# Altium schematic sheet Supplies.SchDoc
size A; DocumentNumber: 6; SheetNumber: 6
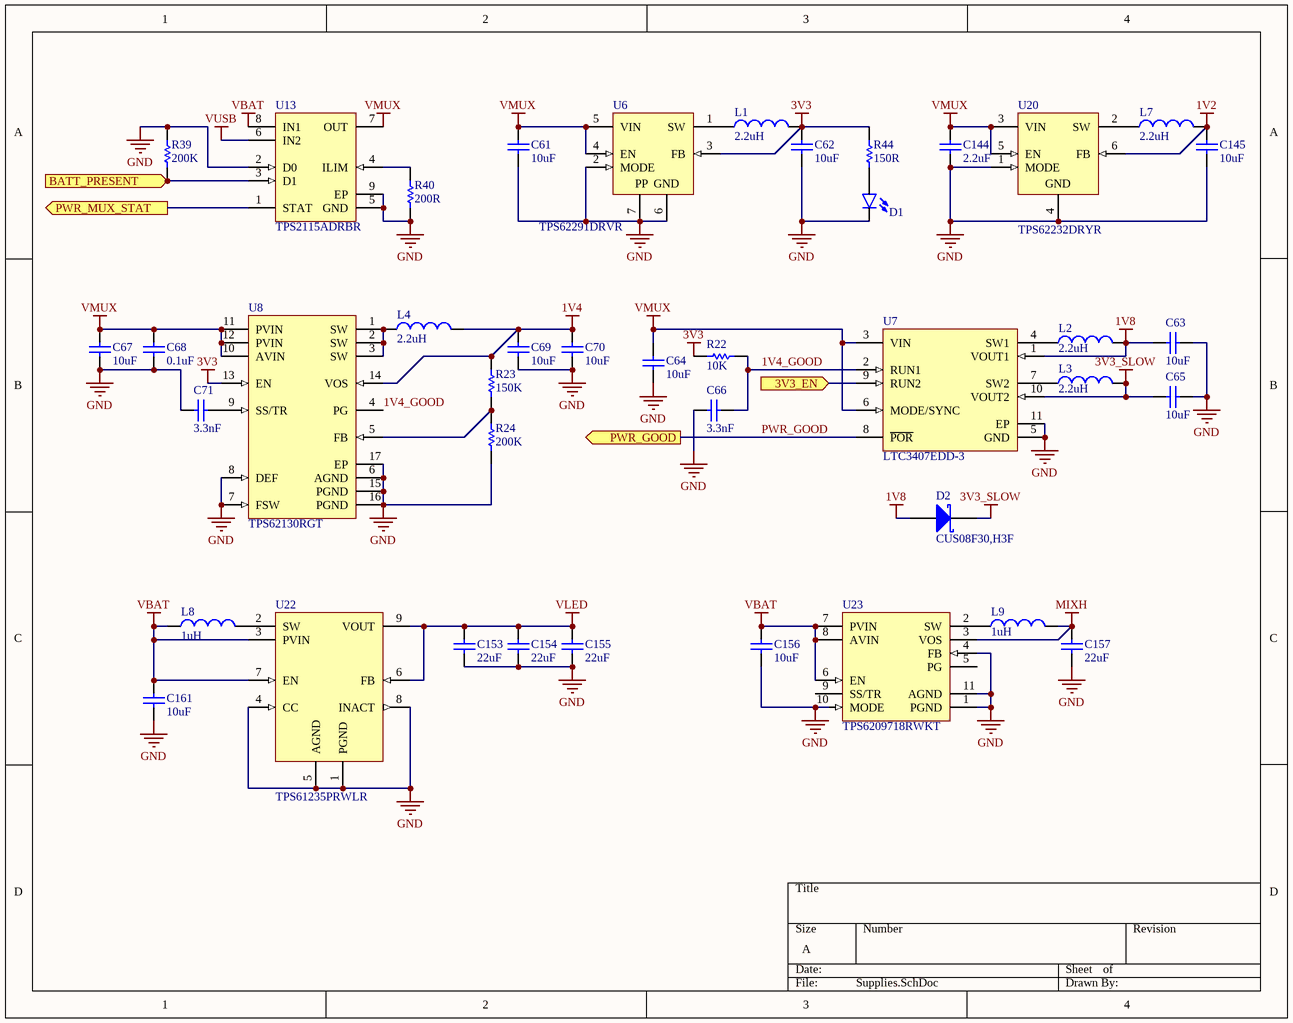
[diagram p0: Supplies.SchDoc]

## Parts
C61  value 10uF  [C0402[1005X55]]  (hidden comment: 10uF 6.3V 0402)
C62  value 10uF  [C0402[1005X55]]  (hidden comment: 10uF 6.3V 0402)
C63  value 10uF  [C0402[1005X55]]  (hidden comment: 10uF 6.3V 0402)
C64  value 10uF  [C0402[1005X55]]  (hidden comment: 10uF 6.3V 0402)
C65  value 10uF  [C0402[1005X55]]  (hidden comment: 10uF 6.3V 0402)
C66  value 3.3nF  [C0402[1005X55]]  (hidden comment: 3.3nF 50V 0402)
C67  value 10uF  [C0402[1005X55]]  (hidden comment: 10uF 6.3V 0402)
C68  value 0.1uF  [C0402[1005X55]]  (hidden comment: 0.1uF 6.3V 0402)
C69  value 10uF  [C0402[1005X55]]  (hidden comment: 10uF 6.3V 0402)
C70  value 10uF  [C0402[1005X55]]  (hidden comment: 10uF 6.3V 0402)
C71  value 3.3nF  [C0402[1005X55]]  (hidden comment: 3.3nF 50V 0402)
C144  value 2.2uF  [C0402[1005X55]]  (hidden comment: 2.2uF 6.3V 0402)
C145  value 10uF  [C0402[1005X55]]  (hidden comment: 10uF 6.3V 0402)
C153  value 22uF  [C0603[1608X92]]  (hidden comment: 22uF 6.3V 0603)
C154  value 22uF  [C0603[1608X92]]  (hidden comment: 22uF 6.3V 0603)
C155  value 22uF  [C0603[1608X92]]  (hidden comment: 22uF 6.3V 0603)
C156  value 10uF  [C0402[1005X55]]  (hidden comment: 10uF 6.3V 0402)
C157  value 22uF  [C0603[1608X92]]  (hidden comment: 22uF 6.3V 0603)
C161  value 10uF  [C0402[1005X55]]  (hidden comment: 10uF 6.3V 0402)
D1  LED_0603_BLUE_5mA  [LED0603]  (value not drawn)
D2  CUS08F30,H3F  [SOD-323]
L1  2.2uH  [IND0805]
L2  2.2uH  [IND0603]
L3  2.2uH  [IND0603]
L4  2.2uH  [IND1008]
L7  2.2uH  [IND0603]
L8  1uH  [IND1008]
L9  1uH  [IND0805]
R22  value 10K  [R0402[1005]]  (hidden comment: 10K 1% 0402)
R23  value 150K  [R0402[1005]]  (hidden comment: 150K 1% 0402)
R24  value 200K  [R0402[1005]]  (hidden comment: 200K 1% 0402)
R39  value 200K  [R0402[1005]]  (hidden comment: 200K 1% 0402)
R40  value 200R  [R0402[1005]]  (hidden comment: 200R 1% 0402)
R44  value 150R  [R0402[1005]]  (hidden comment: 150R 1% 0402)
U6  TPS62291DRVR  [WSON-6]
U7  LTC3407EDD-3  [VSON-10 (3mmx3mm)]
U8  TPS62130RGT  [QFN-16]
U13  TPS2115ADRBR  [VSON-8 (3x3MM)]
U20  TPS62232DRYR  [USON-6]
U22  TPS61235PRWLR  [VQFN-9]
U23  TPS6209718RWKT  [VQFN-11]

## Ports
3V3_EN (in), BATT_PRESENT (in), PWR_GOOD (out), PWR_MUX_STAT (out)

## Nets
1V2: C145.2 L7.2 U20.6(FB)
1V4: C69.2 C70.2 L4.2 R23.2 U8.14(VOS)
1V8: C63.2 D2.2(A) L2.2 U7.1(VOUT1)
3V3: C62.2 L1.2 R22.1 R44.2 U6.3(FB) U8.13(EN)
3V3_SLOW: C65.1 D2.1(K) L3.2 U7.10(VOUT2)
GND: C61.1 C62.1 C63.1 C64.1 C65.2 C66.1 C67.1 C68.1 C69.1 C70.1 C71.1 C144.1 C145.1 C153.1 C154.1 C155.1 C156.1 C157.1 C161.1 D1.C R24.1 R39.2 R40.1 U6.2(MODE) U6.6(GND) U6.7(EP) U7.5(GND) U7.11(EP) U8.6(AGND) U8.7(FSW) U8.8(DEF) U8.15(PGND) U8.16(PGND) U8.17(EP) U13.2(D0) U13.5(GND) U13.9(EP) U20.1(MODE) U20.4(GND) U22.1(PGND) U22.4(CC) U22.5(AGND) U22.8(INACT) U23.1(PGND) U23.4(FB) U23.10(MODE) U23.11(AGND)
MIXH: C157.2 L9.2 U23.3(VOS)
VBAT: C156.2 C161.2 L8.1 U13.8(IN1) U22.3(PVIN) U22.7(EN) U23.6(EN) U23.7(PVIN) U23.8(AVIN)
VLED: C153.2 C154.2 C155.2 U22.6(FB) U22.9(VOUT)
VMUX: C61.2 C64.2 C67.2 C68.2 C144.2 U6.4(EN) U6.5(VIN) U7.3(VIN) U7.6(MODE/SYNC) U8.10(AVIN) U8.11(PVIN) U8.12(PVIN) U13.7(OUT) U20.3(VIN) U20.5(EN)
VUSB: U13.6(IN2)
1V4_GOOD: C66.2 R22.2 U7.2(RUN1) U8.4(PG)
3V3_EN: U7.9(RUN2) ; port 3V3_EN
BATT_PRESENT: R39.1 U13.3(D1) ; port BATT_PRESENT
PWR_GOOD: U7.8(~{POR}) ; port PWR_GOOD
PWR_MUX_STAT: U13.1(STAT) ; port PWR_MUX_STAT
NetC71_2: C71.2 U8.9(SS/TR)
NetD1_A: D1.A R44.1
NetL1_1: L1.1 U6.1(SW)
NetL2_1: L2.1 U7.4(SW1)
NetL3_1: L3.1 U7.7(SW2)
NetL4_1: L4.1 U8.1(SW) U8.2(SW) U8.3(SW)
NetL7_1: L7.1 U20.2(SW)
NetL8_2: L8.2 U22.2(SW)
NetL9_1: L9.1 U23.2(SW)
NetR23_1: R23.1 R24.2 U8.5(FB)
NetR40_2: R40.2 U13.4(ILIM)

Not connected (* = marked no-connect by the designer): U23 5(PG) 9(SS/TR)

## Notes on the sheet
- (in symbol TPS62291DRVR) PP

## Library data of the parts
C61-C65 C67 C69 C70 C145 C156 C161 = CAP_10uF_6.3V_0402_20%: 10uF 6.3V 20% 0402 (1005 Metric); PartNumber: GRM155R60J106ME44D; Manufacturer: Murata; Tolerance: 20%; Mounting Technology: Surface Mount; PackageReference: 0402; PackageDescription: 0402 (1005 Metric); Voltage: 6.3V
C66 C71 = CAP_3.3nF_50V_0402_10%: 3.3nF 50V 10% 0402 (1005 Metric); PartNumber: GRM155R71H332KA01D; Manufacturer: Murata; Mounting Technology: Surface Mount; PackageReference: 0402; PackageDescription: 0402 (1005 Metric); Voltage: 50V; Tolerance: 10%
C68 = CAP_0.1uF_6.3V_0402_10%: 0.1uF 6.3V 10% 0402 (1005 Metric); PartNumber: GRM155R70J104KA01D; Manufacturer: Murata; Mounting Technology: Surface Mount; PackageReference: 0402; PackageDescription: 0402 (1005 Metric); Voltage: 6.3V; Tolerance: 10%
C144 = CAP_2.2uF_6.3V_0402_20%: 2.2uF 6.3V 20% 0402 (1005 Metric); PartNumber: GRM155R60J225ME15D; Manufacturer: Murata; Mounting Technology: Surface Mount; PackageReference: 0402; PackageDescription: 0402 (1005 Metric); Voltage: 6.3V; Tolerance: 20%
C153-C155 C157 = CAP_22uF_6.3V_0603_10%: 22uF 6.3V 10% 0603 (1608 Metric); PartNumber: GRT188R60J226ME13D; Manufacturer: Murata; Mounting Technology: Surface Mount; PackageReference: 0603; PackageDescription: 0603 (1608 Metric); Voltage: 6.3V; Tolerance: 10%
D1 = LED_0603_BLUE_5mA: PartNumber: LTST-C193TBKT-5A; Manufacturer: Lite-On Inc.; PackageReference: 0603; PackageDescription: 0603 (1608 Metric); Mounting Technology: Surface Mount
D2 = CUS08F30,H3F: Manufacturer: Toshiba; PackageReference: SOD-323; PartNumber: CUS08F30,H3F; Mounting Technology: Surface Mount
L1 = IND_2.2uH_1.7A_0805_20%: 2.2uH 20% 1.7A 0805; PartNumber: LQM21PN2R2MGHL; Manufacturer: Murata; PackageReference: 0805; PackageDescription: 0805 (2012 metric); Value: 2.2uH; Mounting Technology: Surface Mount; Current: 1.7A
L2 L3 L7 = IND_2.2uH_750mA_0603_20%: 2.2uH 20% 750mA 0603; PartNumber: LQM18PZ2R2MCHD; Manufacturer: Murata; PackageReference: 0603; PackageDescription: 0603 (1608 metric); Value: 2.2uH; Mounting Technology: Surface Mount; Current: 750mA
L4 = IND_2.2uH_3.3A_1008_20%: 2.2uH 20% 3.3A 1008; PartNumber: DFE252012F-2R2M=P2; Manufacturer: Murata; PackageReference: 1008; PackageDescription: 1008 (2520 metric); Mounting Technology: Surface Mount; Current: 3.3A; Value: 2.2uH
L8 = IND_1uH_4.7A_1008_20%: 1uH 20% 4.7A 1008; PartNumber: DFE252012F-2R2M=P2; Manufacturer: Murata; PackageReference: 1008; PackageDescription: 1008 (2520 metric); Mounting Technology: Surface Mount; Current: 4.7A; Value: 1uH
L9 = IND_1uH_2.3A_0805_20%: 1uH 20% 2.3A 0805; PartNumber: DFE201210S-1R0M=P2; Manufacturer: Murata; PackageReference: 0805; PackageDescription: 0805 (2012 metric); Mounting Technology: Surface Mount; Current: 2.3A; Value: 1uH
R22 = RES_10K_0402_1%: 10K 0.063W 1% 0402 (1005 Metric); Manufacturer: KOA Speer; PartNumber: RK73H1ETTP1002F; Tolerance: 1%; Power: 0.063W; Mounting Technology: Surface Mount; PackageReference: 0402; PackageDescription: 0402 (1005 Metric); ComponentLink1Description: Datasheet; ComponentLink1URL: http://www.koaspeer.com/catimages/Products/RK73H/RK73H.pdf
R23 = RES_150K_0402_1%: 150K 0.063W 1% 0402 (1005 Metric); Manufacturer: KOA Speer; PartNumber: RK73H1ETTP1503F; Tolerance: 1%; Power: 0.063W; Mounting Technology: Surface Mount; PackageReference: 0402; PackageDescription: 0402 (1005 Metric); ComponentLink1Description: Datasheet; ComponentLink1URL: http://www.koaspeer.com/catimages/Products/RK73H/RK73H.pdf
R24 R39 = RES_200K_0402_1%: 200K 0.063W 1% 0402 (1005 Metric); Manufacturer: KOA Speer; PartNumber: RK73H1ETTP2003F; Tolerance: 1%; Power: 0.063W; Mounting Technology: Surface Mount; PackageReference: 0402; PackageDescription: 0402 (1005 Metric); ComponentLink1Description: Datasheet; ComponentLink1URL: http://www.koaspeer.com/catimages/Products/RK73H/RK73H.pdf
R40 = RES_200R_0402_1%: 200R 0.063W 1% 0402 (1005 Metric); Manufacturer: KOA Speer; PartNumber: RK73H1ETTP2000F; Tolerance: 1%; Power: 0.063W; Mounting Technology: Surface Mount; PackageReference: 0402; PackageDescription: 0402 (1005 Metric); ComponentLink1Description: Datasheet; ComponentLink1URL: http://www.koaspeer.com/catimages/Products/RK73H/RK73H.pdf
R44 = RES_150R_0402_1%: 150R 0.063W 1% 0402 (1005 Metric); Manufacturer: KOA Speer; PartNumber: RK73H1ETTP1500F; Tolerance: 1%; Power: 0.063W; Mounting Technology: Surface Mount; PackageReference: 0402; PackageDescription: 0402 (1005 Metric); ComponentLink1Description: Datasheet; ComponentLink1URL: http://www.koaspeer.com/catimages/Products/RK73H/RK73H.pdf
U6 = TPS62291DRVR: Voltage Regulators - Switching Regulators 2.25MHz 1A Step-Down Cnvrtr 3.3V Output; Manufacturer: Texas Instruments; PartNumber: TPS62291DRVR; PackageReference: WSON-6; PackageDescription: SON, 6-Leads, Body 2x2mm, Pitch 0.65mm, Thermal Pad 1.6x1mm, TI Recommended; Mounting Technology: Surface Mount
U7 = LTC3407EDD-3: Manufacturer: Linear Technology; PartNumber: LTC3407EDD-3; PackageReference: SON-10; Mounting Technology: Surface Mount
U8 = TPS62130RGT: Manufacturer: Texas Instruments; PartNumber: TPS62130RGT; PackageReference: QFN-16; Mounting Technology: Surface Mount
U13 = TPS2115ADRBR: Power Switch ICs - Power Distribution Autoswitching Pwr Mux; Manufacturer: Texas Instruments; PartNumber: TPS2115ADRBR; PackageReference: VSON-8; Mounting Technology: Surface Mount
U20 = TPS62232DRYR: Switching Voltage Regulators 3 MHz Ultra Small Step Down Converter; Manufacturer: Texas Instruments; PartNumber: TPS62232DRYR; PackageReference: USON-6; Mounting Technology: Surface Mount
U22 = TPS61235PRWLR: Manufacturer: Texas Instruments; PartNumber: TPS61235PRWLR; PackageReference: VQFN-9; Mounting Technology: Surface Mount
U23 = TPS6209718RWKT: TPS62097 2-A High Efficiency Step-Down Converter with iDCS Control, Forced PWM Mode and Selective Switching Frequency; Manufacturer: Texas Instruments; PartNumber: TPS6209718RWKT; Mounting Technology: Surface Mount; PackageReference: VQFN-11